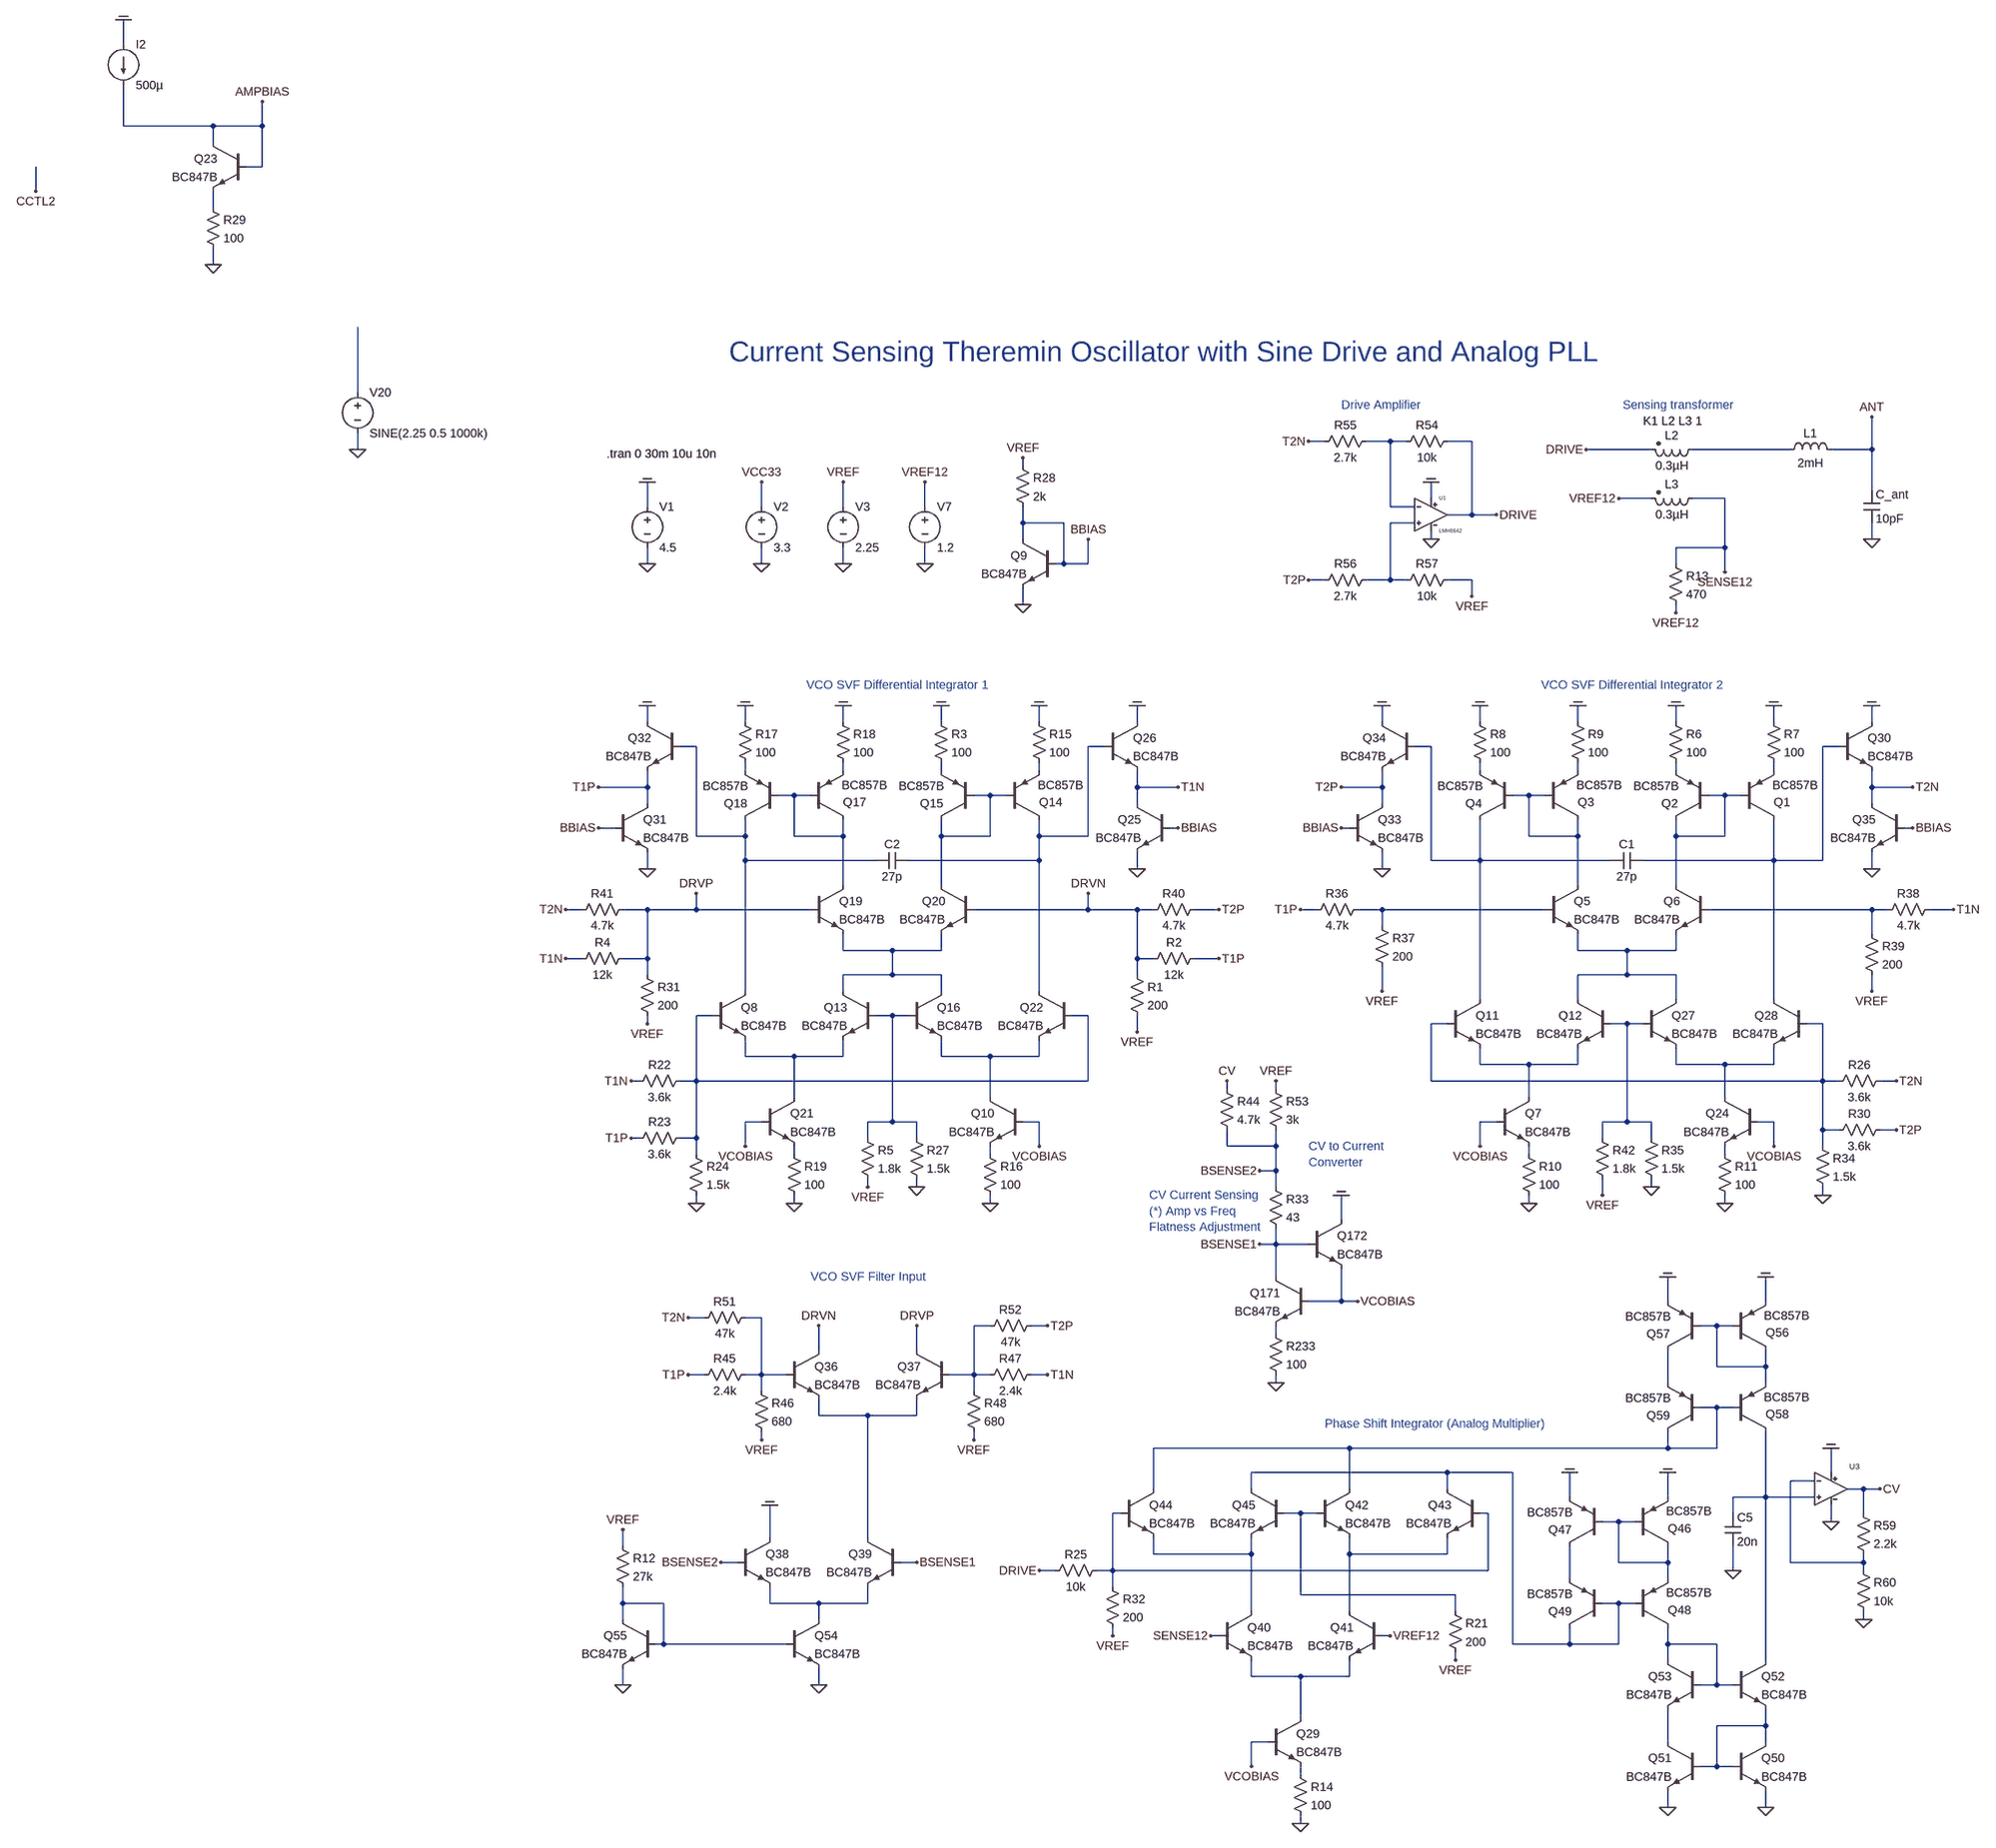
[diagram p0: schematic theremin_oscillator_bjt_pll_v01.asc]
theremin_oscillator_bjt_pll_v01.asc, the LTspice schematic file:
Version 4
SHEET 1 17540 12720
WIRE -192 2960 -192 2912
WIRE -192 3120 -192 3040
WIRE -16 3120 -192 3120
WIRE 80 3120 80 3072
WIRE 80 3120 -16 3120
WIRE -16 3152 -16 3120
WIRE 80 3200 80 3120
WIRE 80 3200 48 3200
WIRE -432 3248 -432 3200
WIRE -16 3280 -16 3248
WIRE -16 3392 -16 3360
WIRE 592 3664 592 3536
WIRE 5200 3760 5168 3760
WIRE 5328 3760 5280 3760
WIRE 5360 3760 5328 3760
WIRE 5488 3760 5440 3760
WIRE 592 3776 592 3744
WIRE 5840 3776 5712 3776
WIRE 6112 3776 5920 3776
WIRE 6272 3776 6272 3712
WIRE 6272 3776 6192 3776
WIRE 4608 3808 4608 3792
WIRE 6272 3856 6272 3776
WIRE 5408 3872 5408 3840
WIRE 5840 3872 5776 3872
WIRE 5984 3872 5920 3872
WIRE 3872 3888 3872 3840
WIRE 4096 3888 4096 3840
WIRE 4256 3888 4256 3840
WIRE 4416 3888 4416 3840
WIRE 5328 3888 5328 3760
WIRE 5376 3888 5328 3888
WIRE 5488 3904 5488 3760
WIRE 5488 3904 5440 3904
WIRE 5536 3904 5488 3904
WIRE 4608 3920 4608 3888
WIRE 4688 3920 4608 3920
WIRE 5376 3920 5328 3920
WIRE 4608 3952 4608 3920
WIRE 5408 3952 5408 3936
WIRE 6272 3952 6272 3920
WIRE 5984 3968 5984 3872
WIRE 5984 3968 5888 3968
WIRE 3872 4000 3872 3968
WIRE 4096 4000 4096 3968
WIRE 4256 4000 4256 3968
WIRE 4416 4000 4416 3968
WIRE 4688 4000 4688 3920
WIRE 4688 4000 4672 4000
WIRE 4736 4000 4736 3952
WIRE 4736 4000 4688 4000
WIRE 5888 4000 5888 3968
WIRE 5984 4016 5984 3968
WIRE 5200 4032 5168 4032
WIRE 5328 4032 5328 3920
WIRE 5328 4032 5280 4032
WIRE 5360 4032 5328 4032
WIRE 5488 4032 5440 4032
WIRE 5488 4064 5488 4032
WIRE 4608 4080 4608 4048
WIRE 5888 4096 5888 4080
WIRE 3872 4320 3872 4288
WIRE 4064 4320 4064 4288
WIRE 4256 4320 4256 4288
WIRE 4448 4320 4448 4288
WIRE 4640 4320 4640 4288
WIRE 4832 4320 4832 4288
WIRE 5312 4320 5312 4288
WIRE 5504 4320 5504 4288
WIRE 5696 4320 5696 4288
WIRE 5888 4320 5888 4288
WIRE 6080 4320 6080 4288
WIRE 6272 4320 6272 4288
WIRE 3968 4368 3936 4368
WIRE 4768 4368 4736 4368
WIRE 5408 4368 5376 4368
WIRE 6208 4368 6176 4368
WIRE 4064 4416 4064 4400
WIRE 4256 4416 4256 4400
WIRE 4448 4416 4448 4400
WIRE 4640 4416 4640 4400
WIRE 5504 4416 5504 4400
WIRE 5696 4416 5696 4400
WIRE 5888 4416 5888 4400
WIRE 6080 4416 6080 4400
WIRE 3872 4448 3872 4416
WIRE 3872 4448 3776 4448
WIRE 4832 4448 4832 4416
WIRE 4912 4448 4832 4448
WIRE 5312 4448 5312 4416
WIRE 5312 4448 5232 4448
WIRE 6272 4448 6272 4416
WIRE 6352 4448 6272 4448
WIRE 4160 4464 4128 4464
WIRE 4192 4464 4160 4464
WIRE 4544 4464 4512 4464
WIRE 4576 4464 4544 4464
WIRE 5600 4464 5568 4464
WIRE 5632 4464 5600 4464
WIRE 5984 4464 5952 4464
WIRE 6016 4464 5984 4464
WIRE 3872 4480 3872 4448
WIRE 4832 4480 4832 4448
WIRE 5312 4480 5312 4448
WIRE 6272 4480 6272 4448
WIRE 3808 4528 3776 4528
WIRE 4912 4528 4896 4528
WIRE 5248 4528 5232 4528
WIRE 6352 4528 6336 4528
WIRE 3968 4544 3968 4368
WIRE 4064 4544 4064 4512
WIRE 4064 4544 3968 4544
WIRE 4160 4544 4160 4464
WIRE 4256 4544 4256 4512
WIRE 4256 4544 4160 4544
WIRE 4448 4544 4448 4512
WIRE 4544 4544 4544 4464
WIRE 4544 4544 4448 4544
WIRE 4640 4544 4640 4512
WIRE 4736 4544 4736 4368
WIRE 4736 4544 4640 4544
WIRE 5600 4544 5600 4464
WIRE 5696 4544 5696 4512
WIRE 5696 4544 5600 4544
WIRE 5888 4544 5888 4512
WIRE 5984 4544 5984 4464
WIRE 5984 4544 5888 4544
WIRE 4064 4592 4064 4544
WIRE 4320 4592 4064 4592
WIRE 4640 4592 4640 4544
WIRE 4640 4592 4384 4592
WIRE 5408 4592 5408 4368
WIRE 5504 4592 5504 4512
WIRE 5504 4592 5408 4592
WIRE 5760 4592 5504 4592
WIRE 6080 4592 6080 4512
WIRE 6080 4592 5824 4592
WIRE 6176 4592 6176 4368
WIRE 6176 4592 6080 4592
WIRE 3872 4608 3872 4576
WIRE 4832 4608 4832 4576
WIRE 5312 4608 5312 4576
WIRE 6272 4608 6272 4576
WIRE 4256 4640 4256 4544
WIRE 4448 4640 4448 4544
WIRE 5696 4640 5696 4544
WIRE 5888 4640 5888 4544
WIRE 3744 4688 3712 4688
WIRE 3872 4688 3824 4688
WIRE 3968 4688 3968 4656
WIRE 3968 4688 3872 4688
WIRE 4192 4688 3968 4688
WIRE 4736 4688 4736 4656
WIRE 4736 4688 4512 4688
WIRE 4832 4688 4736 4688
WIRE 4864 4688 4832 4688
WIRE 4992 4688 4944 4688
WIRE 5184 4688 5152 4688
WIRE 5312 4688 5264 4688
WIRE 5632 4688 5312 4688
WIRE 6272 4688 5952 4688
WIRE 6304 4688 6272 4688
WIRE 6432 4688 6384 4688
WIRE 5312 4720 5312 4688
WIRE 6272 4736 6272 4688
WIRE 4256 4768 4256 4736
WIRE 4352 4768 4256 4768
WIRE 4448 4768 4448 4736
WIRE 4448 4768 4352 4768
WIRE 5696 4768 5696 4736
WIRE 5792 4768 5696 4768
WIRE 5888 4768 5888 4736
WIRE 5888 4768 5792 4768
WIRE 3744 4784 3712 4784
WIRE 3872 4784 3872 4688
WIRE 3872 4784 3824 4784
WIRE 4832 4784 4832 4688
WIRE 4864 4784 4832 4784
WIRE 4992 4784 4944 4784
WIRE 3872 4816 3872 4784
WIRE 4352 4816 4352 4768
WIRE 4352 4816 4256 4816
WIRE 4448 4816 4352 4816
WIRE 4832 4816 4832 4784
WIRE 5792 4816 5792 4768
WIRE 5792 4816 5696 4816
WIRE 5888 4816 5792 4816
WIRE 4064 4848 4064 4592
WIRE 4256 4848 4256 4816
WIRE 4448 4848 4448 4816
WIRE 4640 4848 4640 4592
WIRE 5312 4848 5312 4800
WIRE 6272 4848 6272 4816
WIRE 5504 4864 5504 4592
WIRE 5696 4864 5696 4816
WIRE 5888 4864 5888 4816
WIRE 6080 4864 6080 4592
WIRE 4000 4896 3968 4896
WIRE 4352 4896 4320 4896
WIRE 4384 4896 4352 4896
WIRE 4736 4896 4704 4896
WIRE 3872 4912 3872 4896
WIRE 5440 4912 5408 4912
WIRE 5792 4912 5760 4912
WIRE 5824 4912 5792 4912
WIRE 6176 4912 6144 4912
WIRE 4832 4928 4832 4896
WIRE 4064 4976 4064 4944
WIRE 4160 4976 4064 4976
WIRE 4256 4976 4256 4944
WIRE 4256 4976 4160 4976
WIRE 4448 4976 4448 4944
WIRE 4544 4976 4448 4976
WIRE 4640 4976 4640 4944
WIRE 4640 4976 4544 4976
WIRE 5504 4992 5504 4960
WIRE 5600 4992 5504 4992
WIRE 5696 4992 5696 4960
WIRE 5696 4992 5600 4992
WIRE 5888 4992 5888 4960
WIRE 5984 4992 5888 4992
WIRE 6080 4992 6080 4960
WIRE 6080 4992 5984 4992
WIRE 3856 5024 3840 5024
WIRE 3968 5024 3968 4896
WIRE 3968 5024 3936 5024
WIRE 4736 5024 4736 4896
WIRE 4736 5024 3968 5024
WIRE 5408 5024 5408 4912
WIRE 6176 5024 6176 4912
WIRE 6176 5024 5408 5024
WIRE 6208 5024 6176 5024
WIRE 6320 5024 6288 5024
WIRE 5008 5040 5008 5024
WIRE 5104 5040 5104 5024
WIRE 4160 5056 4160 4976
WIRE 4544 5056 4544 4976
WIRE 5600 5056 5600 4992
WIRE 5984 5056 5984 4992
WIRE 4096 5104 4064 5104
WIRE 4352 5104 4352 4896
WIRE 4352 5104 4304 5104
WIRE 4400 5104 4352 5104
WIRE 4640 5104 4608 5104
WIRE 5536 5104 5504 5104
WIRE 5792 5104 5792 4912
WIRE 5792 5104 5744 5104
WIRE 5840 5104 5792 5104
WIRE 6080 5104 6048 5104
WIRE 6176 5120 6176 5024
WIRE 6208 5120 6176 5120
WIRE 6320 5120 6288 5120
WIRE 3856 5136 3840 5136
WIRE 3968 5136 3968 5024
WIRE 3968 5136 3936 5136
WIRE 4304 5136 4304 5104
WIRE 4400 5136 4400 5104
WIRE 5744 5136 5744 5104
WIRE 5840 5136 5840 5104
WIRE 4064 5152 4064 5104
WIRE 4640 5152 4640 5104
WIRE 5008 5152 5008 5120
WIRE 5104 5152 5104 5120
WIRE 5104 5152 5008 5152
WIRE 5504 5152 5504 5104
WIRE 6080 5152 6080 5104
WIRE 6176 5152 6176 5120
WIRE 3968 5168 3968 5136
WIRE 4160 5168 4160 5152
WIRE 4544 5168 4544 5152
WIRE 5600 5168 5600 5152
WIRE 5984 5168 5984 5152
WIRE 5104 5200 5104 5152
WIRE 5104 5200 5072 5200
WIRE 4304 5232 4304 5216
WIRE 4400 5232 4400 5216
WIRE 5104 5232 5104 5200
WIRE 5840 5232 5840 5216
WIRE 5744 5248 5744 5216
WIRE 6176 5248 6176 5232
WIRE 3968 5264 3968 5248
WIRE 4160 5264 4160 5248
WIRE 4544 5264 4544 5248
WIRE 5600 5264 5600 5248
WIRE 5984 5264 5984 5248
WIRE 5232 5296 5232 5248
WIRE 5104 5344 5104 5312
WIRE 5104 5344 5072 5344
WIRE 5168 5344 5104 5344
WIRE 5104 5408 5104 5344
WIRE 5232 5456 5232 5392
WIRE 5232 5456 5168 5456
WIRE 5264 5456 5232 5456
WIRE 5872 5456 5872 5408
WIRE 6064 5456 6064 5408
WIRE 3984 5488 3952 5488
WIRE 4096 5488 4064 5488
WIRE 4544 5504 4512 5504
WIRE 4656 5504 4624 5504
WIRE 5968 5504 5936 5504
WIRE 6000 5504 5968 5504
WIRE 5104 5520 5104 5504
WIRE 4208 5552 4208 5504
WIRE 4400 5552 4400 5504
WIRE 5968 5584 5968 5504
WIRE 6064 5584 6064 5552
WIRE 6064 5584 5968 5584
WIRE 3984 5600 3952 5600
WIRE 4096 5600 4096 5488
WIRE 4096 5600 4064 5600
WIRE 4144 5600 4096 5600
WIRE 4512 5600 4512 5504
WIRE 4512 5600 4464 5600
WIRE 4544 5600 4512 5600
WIRE 4656 5600 4624 5600
WIRE 5104 5616 5104 5600
WIRE 5872 5616 5872 5552
WIRE 6064 5616 6064 5584
WIRE 4096 5632 4096 5600
WIRE 4512 5632 4512 5600
WIRE 5968 5664 5936 5664
WIRE 6000 5664 5968 5664
WIRE 4208 5680 4208 5648
WIRE 4304 5680 4208 5680
WIRE 4400 5680 4400 5648
WIRE 4400 5680 4304 5680
WIRE 4096 5728 4096 5712
WIRE 4512 5728 4512 5712
WIRE 5248 5744 4864 5744
WIRE 5872 5744 5872 5712
WIRE 5872 5744 5248 5744
WIRE 5968 5744 5968 5664
WIRE 5968 5744 5872 5744
WIRE 5440 5792 5056 5792
WIRE 5568 5792 5440 5792
WIRE 6192 5792 6192 5744
WIRE 6160 5808 6112 5808
WIRE 4864 5824 4864 5744
WIRE 5056 5824 5056 5792
WIRE 5248 5824 5248 5744
WIRE 5440 5824 5440 5792
WIRE 6256 5824 6224 5824
WIRE 6288 5824 6256 5824
WIRE 5680 5840 5680 5792
WIRE 5872 5840 5872 5792
WIRE 6064 5840 6064 5712
WIRE 6064 5840 6000 5840
WIRE 6160 5840 6064 5840
WIRE 4800 5872 4784 5872
WIRE 5152 5872 5120 5872
WIRE 5184 5872 5152 5872
WIRE 5520 5872 5504 5872
WIRE 6000 5872 6000 5840
WIRE 6256 5872 6256 5824
WIRE 5776 5888 5744 5888
WIRE 5808 5888 5776 5888
WIRE 6192 5888 6192 5856
WIRE 4112 5920 4112 5856
WIRE 4304 5920 4304 5680
WIRE 3824 5936 3824 5904
WIRE 4864 5952 4864 5920
WIRE 5056 5952 5056 5920
WIRE 5056 5952 4864 5952
WIRE 5248 5952 5248 5920
WIRE 5440 5952 5440 5920
WIRE 5440 5952 5248 5952
WIRE 4048 5968 4016 5968
WIRE 4400 5968 4368 5968
WIRE 5776 5968 5776 5888
WIRE 5872 5968 5872 5936
WIRE 5872 5968 5776 5968
WIRE 6112 5968 6112 5808
WIRE 6256 5968 6256 5952
WIRE 6256 5968 6112 5968
WIRE 4672 5984 4640 5984
WIRE 4784 5984 4784 5872
WIRE 4784 5984 4752 5984
WIRE 5520 5984 5520 5872
WIRE 5520 5984 4784 5984
WIRE 6000 5984 6000 5936
WIRE 6256 5984 6256 5968
WIRE 5680 6000 5680 5936
WIRE 5872 6000 5872 5968
WIRE 4784 6016 4784 5984
WIRE 5152 6032 5152 5872
WIRE 5456 6032 5152 6032
WIRE 3824 6048 3824 6016
WIRE 3904 6048 3824 6048
WIRE 4112 6048 4112 6016
WIRE 4208 6048 4112 6048
WIRE 4304 6048 4304 6016
WIRE 4304 6048 4208 6048
WIRE 5776 6048 5744 6048
WIRE 5808 6048 5776 6048
WIRE 5056 6064 5056 5952
WIRE 5248 6064 5248 5952
WIRE 5456 6064 5456 6032
WIRE 3824 6080 3824 6048
WIRE 4208 6080 4208 6048
WIRE 6256 6080 6256 6064
WIRE 4784 6112 4784 6096
WIRE 4992 6112 4976 6112
WIRE 5328 6112 5312 6112
WIRE 3904 6128 3904 6048
WIRE 3904 6128 3888 6128
WIRE 4144 6128 3904 6128
WIRE 5568 6128 5568 5792
WIRE 5680 6128 5680 6096
WIRE 5680 6128 5568 6128
WIRE 5776 6128 5776 6048
WIRE 5776 6128 5680 6128
WIRE 5872 6128 5872 6096
WIRE 5968 6128 5872 6128
WIRE 5456 6160 5456 6144
WIRE 5872 6160 5872 6128
WIRE 6064 6160 6064 5840
WIRE 5056 6192 5056 6160
WIRE 5152 6192 5056 6192
WIRE 5248 6192 5248 6160
WIRE 5248 6192 5152 6192
WIRE 3824 6208 3824 6176
WIRE 4208 6208 4208 6176
WIRE 5968 6208 5968 6128
WIRE 5968 6208 5936 6208
WIRE 6000 6208 5968 6208
WIRE 5152 6272 5152 6192
WIRE 6064 6288 6064 6256
WIRE 6064 6288 5968 6288
WIRE 5088 6320 5056 6320
WIRE 5872 6320 5872 6256
WIRE 6064 6320 6064 6288
WIRE 5056 6368 5056 6320
WIRE 5968 6368 5968 6288
WIRE 5968 6368 5936 6368
WIRE 6000 6368 5968 6368
WIRE 5152 6384 5152 6368
WIRE 5872 6448 5872 6416
WIRE 6064 6448 6064 6416
WIRE 5152 6480 5152 6464
FLAG 3872 4000 0
FLAG 3872 3840 COM
FLAG 4096 4000 0
FLAG 4096 3840 VCC33
FLAG 4256 4000 0
FLAG 4256 3840 VREF
FLAG 6272 3712 ANT
FLAG 6272 3952 0
FLAG 5712 3776 DRIVE
FLAG 4416 4000 0
FLAG 4416 3840 VREF12
FLAG 5776 3872 VREF12
FLAG 5984 4016 SENSE12
FLAG 5888 4096 VREF12
FLAG -432 3248 CCTL2
FLAG 592 3776 0
FLAG 5104 5616 0
FLAG 5232 5248 COM
FLAG 5264 5456 VCOBIAS
FLAG -16 3392 0
FLAG -192 2912 COM
FLAG 80 3072 AMPBIAS
FLAG 5072 5344 BSENSE1
FLAG 5072 5200 BSENSE2
FLAG 4608 4080 0
FLAG 4736 3952 BBIAS
FLAG 4608 3792 VREF
FLAG 4448 4288 COM
FLAG 4640 4288 COM
FLAG 4064 4288 COM
FLAG 4256 4288 COM
FLAG 4160 5264 0
FLAG 4064 5152 VCOBIAS
FLAG 4544 5264 0
FLAG 4640 5152 VCOBIAS
FLAG 4832 4608 0
FLAG 4832 4288 COM
FLAG 4912 4448 T1N
FLAG 3872 4608 0
FLAG 3776 4528 BBIAS
FLAG 3872 4288 COM
FLAG 4912 4528 BBIAS
FLAG 3776 4448 T1P
FLAG 3968 5264 0
FLAG 3840 5136 T1P
FLAG 3840 5024 T1N
FLAG 4400 5232 0
FLAG 3872 4912 VREF
FLAG 4832 4928 VREF
FLAG 4992 4784 T1P
FLAG 3712 4784 T1N
FLAG 4304 5232 VREF
FLAG 5888 4288 COM
FLAG 6080 4288 COM
FLAG 5504 4288 COM
FLAG 5696 4288 COM
FLAG 5600 5264 0
FLAG 5504 5152 VCOBIAS
FLAG 5984 5264 0
FLAG 6080 5152 VCOBIAS
FLAG 6272 4608 0
FLAG 6272 4288 COM
FLAG 6352 4448 T2N
FLAG 5312 4608 0
FLAG 5232 4528 BBIAS
FLAG 5312 4288 COM
FLAG 6352 4528 BBIAS
FLAG 5232 4448 T2P
FLAG 6176 5248 0
FLAG 6320 5120 T2P
FLAG 6320 5024 T2N
FLAG 5840 5232 0
FLAG 5152 4688 T1P
FLAG 6432 4688 T1N
FLAG 5312 4848 VREF
FLAG 6272 4848 VREF
FLAG 5744 5248 VREF
FLAG 4992 4688 T2P
FLAG 3712 4688 T2N
FLAG 4208 6208 0
FLAG 3824 6208 0
FLAG 3824 5904 VREF
FLAG 4736 4656 DRVN
FLAG 3968 4656 DRVP
FLAG 3952 5600 T1P
FLAG 4656 5600 T1N
FLAG 4512 5728 VREF
FLAG 4208 5504 DRVN
FLAG 4400 5504 DRVP
FLAG 3952 5488 T2N
FLAG 4656 5504 T2P
FLAG 4096 5728 VREF
FLAG 4016 5968 BSENSE2
FLAG 4400 5968 BSENSE1
FLAG 5408 3840 COM
FLAG 5408 3952 0
FLAG 5168 3760 T2N
FLAG 5168 4032 T2P
FLAG 5488 4064 VREF
FLAG 5536 3904 DRIVE
FLAG 4112 5856 COM
FLAG 5152 6480 0
FLAG 5056 6368 VCOBIAS
FLAG 5328 6112 VREF12
FLAG 4976 6112 SENSE12
FLAG 5680 5792 COM
FLAG 5872 5792 COM
FLAG 6064 6448 0
FLAG 5872 6448 0
FLAG 5872 5408 COM
FLAG 6064 5408 COM
FLAG 5456 6160 VREF
FLAG 4640 5984 DRIVE
FLAG 4784 6112 VREF
FLAG 6288 5824 CV
FLAG 5008 5024 CV
FLAG 5104 5024 VREF
FLAG 6192 5888 0
FLAG 6192 5744 COM
FLAG 6256 6080 0
FLAG 6000 5984 0
SYMBOL voltage 3872 3872 R0
SYMATTR InstName V1
SYMATTR Value 4.5
SYMBOL voltage 4096 3872 R0
SYMATTR InstName V2
SYMATTR Value 3.3
SYMBOL voltage 4256 3872 R0
SYMATTR InstName V3
SYMATTR Value 2.25
SYMBOL ind 6096 3792 R270
WINDOW 0 32 56 VTop 2
WINDOW 3 5 56 VBottom 2
SYMATTR InstName L1
SYMATTR Value 2mH
SYMATTR SpiceLine Rser=120 Cpar=1pF
SYMBOL Cap 6256 3856 R0
SYMATTR InstName C_ant
SYMATTR Value 10pF
SYMBOL voltage 4416 3872 R0
SYMATTR InstName V7
SYMATTR Value 1.2
SYMBOL ind2 5936 3760 R90
WINDOW 0 4 56 VBottom 2
WINDOW 3 32 56 VTop 2
SYMATTR InstName L2
SYMATTR Value 0.3µH
SYMATTR SpiceLine Rser=0.1 Cpar=0.1p
SYMBOL ind2 5936 3856 R90
WINDOW 0 4 56 VBottom 2
WINDOW 3 32 56 VTop 2
SYMATTR InstName L3
SYMATTR Value 0.3µH
SYMATTR SpiceLine Rser=0.1 Cpar=0.1p
SYMBOL Res 5872 3984 R0
SYMATTR InstName R13
SYMATTR Value 470
SYMBOL Voltage 592 3648 R0
SYMATTR InstName V20
SYMATTR Value SINE(2.25 0.5 1000k)
SYMBOL Res 5088 5504 R0
SYMATTR InstName R233
SYMATTR Value 100
SYMBOL npn 5168 5408 M0
SYMATTR InstName Q171
SYMATTR Value BC847B
SYMBOL npn 5168 5296 R0
SYMATTR InstName Q172
SYMATTR Value BC847B
SYMBOL npn 48 3152 M0
SYMATTR InstName Q23
SYMATTR Value BC847B
SYMBOL Res -32 3264 R0
SYMATTR InstName R29
SYMATTR Value 100
SYMBOL current -192 2960 R0
SYMATTR InstName I2
SYMATTR Value 500µ
SYMBOL Res 5088 5216 R0
SYMATTR InstName R33
SYMATTR Value 43
SYMBOL npn 4672 3952 M0
SYMATTR InstName Q9
SYMATTR Value BC847B
SYMBOL pnp 4576 4512 M180
WINDOW 0 64 34 Left 2
WINDOW 3 61 68 Left 2
SYMATTR InstName Q14
SYMATTR Value BC857B
SYMBOL pnp 4512 4512 R180
WINDOW 0 60 32 Left 2
WINDOW 3 58 66 Left 2
SYMATTR InstName Q15
SYMATTR Value BC857B
SYMBOL Res 4432 4304 R0
SYMATTR InstName R3
SYMATTR Value 100
SYMBOL Res 4624 4304 R0
SYMATTR InstName R15
SYMATTR Value 100
SYMBOL pnp 4192 4512 M180
WINDOW 0 64 34 Left 2
WINDOW 3 61 68 Left 2
SYMATTR InstName Q17
SYMATTR Value BC857B
SYMBOL pnp 4128 4512 R180
WINDOW 0 60 32 Left 2
WINDOW 3 58 66 Left 2
SYMATTR InstName Q18
SYMATTR Value BC857B
SYMBOL Res 4048 4304 R0
SYMATTR InstName R17
SYMATTR Value 100
SYMBOL Res 4240 4304 R0
SYMATTR InstName R18
SYMATTR Value 100
SYMBOL npn 4192 4640 R0
SYMATTR InstName Q19
SYMATTR Value BC847B
SYMBOL npn 4512 4640 M0
SYMATTR InstName Q20
SYMATTR Value BC847B
SYMBOL Res 4144 5152 R0
SYMATTR InstName R19
SYMATTR Value 100
SYMBOL npn 4096 5056 R0
SYMATTR InstName Q21
SYMATTR Value BC847B
SYMBOL npn 4000 4848 R0
SYMATTR InstName Q8
SYMATTR Value BC847B
SYMBOL npn 4320 4848 M0
SYMATTR InstName Q13
SYMATTR Value BC847B
SYMBOL npn 4384 4848 R0
SYMATTR InstName Q16
SYMATTR Value BC847B
SYMBOL npn 4704 4848 M0
SYMATTR InstName Q22
SYMATTR Value BC847B
SYMBOL Res 4528 5152 R0
SYMATTR InstName R16
SYMATTR Value 100
SYMBOL Cap 4384 4576 R90
WINDOW 0 0 32 VBottom 2
WINDOW 3 32 32 VTop 2
SYMATTR InstName C2
SYMATTR Value 27p
SYMBOL npn 4768 4320 R0
SYMATTR InstName Q26
SYMATTR Value BC847B
SYMBOL npn 3808 4480 R0
SYMATTR InstName Q31
SYMATTR Value BC847B
SYMBOL npn 3936 4320 M0
SYMATTR InstName Q32
SYMATTR Value BC847B
SYMBOL npn 4896 4480 M0
SYMATTR InstName Q25
SYMATTR Value BC847B
SYMBOL Res 3952 5008 R90
WINDOW 0 0 56 VBottom 2
WINDOW 3 32 56 VTop 2
SYMATTR InstName R22
SYMATTR Value 3.6k
SYMBOL Res 3952 5120 R90
WINDOW 0 0 56 VBottom 2
WINDOW 3 32 56 VTop 2
SYMATTR InstName R23
SYMATTR Value 3.6k
SYMBOL Res 3952 5152 R0
SYMATTR InstName R24
SYMATTR Value 1.5k
SYMBOL Res 4384 5120 R0
SYMATTR InstName R27
SYMATTR Value 1.5k
SYMBOL Res 3856 4800 R0
SYMATTR InstName R31
SYMATTR Value 200
SYMBOL Res 4816 4800 R0
SYMATTR InstName R1
SYMATTR Value 200
SYMBOL Res 4960 4768 R90
WINDOW 0 0 56 VBottom 2
WINDOW 3 32 56 VTop 2
SYMATTR InstName R2
SYMATTR Value 12k
SYMBOL Res 3840 4768 R90
WINDOW 0 0 56 VBottom 2
WINDOW 3 32 56 VTop 2
SYMATTR InstName R4
SYMATTR Value 12k
SYMBOL Res 4288 5120 R0
SYMATTR InstName R5
SYMATTR Value 1.8k
SYMBOL pnp 6016 4512 M180
WINDOW 0 64 34 Left 2
WINDOW 3 61 68 Left 2
SYMATTR InstName Q1
SYMATTR Value BC857B
SYMBOL pnp 5952 4512 R180
WINDOW 0 60 32 Left 2
WINDOW 3 58 66 Left 2
SYMATTR InstName Q2
SYMATTR Value BC857B
SYMBOL Res 5872 4304 R0
SYMATTR InstName R6
SYMATTR Value 100
SYMBOL Res 6064 4304 R0
SYMATTR InstName R7
SYMATTR Value 100
SYMBOL pnp 5632 4512 M180
WINDOW 0 64 34 Left 2
WINDOW 3 61 68 Left 2
SYMATTR InstName Q3
SYMATTR Value BC857B
SYMBOL pnp 5568 4512 R180
WINDOW 0 60 32 Left 2
WINDOW 3 58 66 Left 2
SYMATTR InstName Q4
SYMATTR Value BC857B
SYMBOL Res 5488 4304 R0
SYMATTR InstName R8
SYMATTR Value 100
SYMBOL Res 5680 4304 R0
SYMATTR InstName R9
SYMATTR Value 100
SYMBOL npn 5632 4640 R0
SYMATTR InstName Q5
SYMATTR Value BC847B
SYMBOL npn 5952 4640 M0
SYMATTR InstName Q6
SYMATTR Value BC847B
SYMBOL Res 5584 5152 R0
SYMATTR InstName R10
SYMATTR Value 100
SYMBOL npn 5536 5056 R0
SYMATTR InstName Q7
SYMATTR Value BC847B
SYMBOL npn 5440 4864 R0
SYMATTR InstName Q11
SYMATTR Value BC847B
SYMBOL npn 5760 4864 M0
SYMATTR InstName Q12
SYMATTR Value BC847B
SYMBOL npn 5824 4864 R0
SYMATTR InstName Q27
SYMATTR Value BC847B
SYMBOL npn 6144 4864 M0
SYMATTR InstName Q28
SYMATTR Value BC847B
SYMBOL Res 5968 5152 R0
SYMATTR InstName R11
SYMATTR Value 100
SYMBOL Cap 5824 4576 R90
WINDOW 0 0 32 VBottom 2
WINDOW 3 32 32 VTop 2
SYMATTR InstName C1
SYMATTR Value 27p
SYMBOL npn 6208 4320 R0
SYMATTR InstName Q30
SYMATTR Value BC847B
SYMBOL npn 5248 4480 R0
SYMATTR InstName Q33
SYMATTR Value BC847B
SYMBOL npn 5376 4320 M0
SYMATTR InstName Q34
SYMATTR Value BC847B
SYMBOL npn 6336 4480 M0
SYMATTR InstName Q35
SYMATTR Value BC847B
SYMBOL Res 6304 5008 R90
WINDOW 0 0 56 VBottom 2
WINDOW 3 32 56 VTop 2
SYMATTR InstName R26
SYMATTR Value 3.6k
SYMBOL Res 6304 5104 R90
WINDOW 0 0 56 VBottom 2
WINDOW 3 32 56 VTop 2
SYMATTR InstName R30
SYMATTR Value 3.6k
SYMBOL Res 6160 5136 R0
SYMATTR InstName R34
SYMATTR Value 1.5k
SYMBOL Res 5824 5120 R0
SYMATTR InstName R35
SYMATTR Value 1.5k
SYMBOL Res 5280 4672 R90
WINDOW 0 0 56 VBottom 2
WINDOW 3 32 56 VTop 2
SYMATTR InstName R36
SYMATTR Value 4.7k
SYMBOL Res 5296 4704 R0
SYMATTR InstName R37
SYMATTR Value 200
SYMBOL Res 6400 4672 R90
WINDOW 0 0 56 VBottom 2
WINDOW 3 32 56 VTop 2
SYMATTR InstName R38
SYMATTR Value 4.7k
SYMBOL Res 6256 4720 R0
SYMATTR InstName R39
SYMATTR Value 200
SYMBOL Res 5728 5120 R0
SYMATTR InstName R42
SYMATTR Value 1.8k
SYMBOL Res 4960 4672 R90
WINDOW 0 0 56 VBottom 2
WINDOW 3 32 56 VTop 2
SYMATTR InstName R40
SYMATTR Value 4.7k
SYMBOL Res 3840 4672 R90
WINDOW 0 0 56 VBottom 2
WINDOW 3 32 56 VTop 2
SYMATTR InstName R41
SYMATTR Value 4.7k
SYMBOL npn 4144 6080 R0
SYMATTR InstName Q54
SYMATTR Value BC847B
SYMBOL npn 3888 6080 M0
SYMATTR InstName Q55
SYMATTR Value BC847B
SYMBOL npn 4144 5552 R0
SYMATTR InstName Q36
SYMATTR Value BC847B
SYMBOL npn 4464 5552 M0
SYMATTR InstName Q37
SYMATTR Value BC847B
SYMBOL Res 4080 5584 R90
WINDOW 0 0 56 VBottom 2
WINDOW 3 32 56 VTop 2
SYMATTR InstName R45
SYMATTR Value 2.4k
SYMBOL Res 4080 5616 R0
SYMATTR InstName R46
SYMATTR Value 680
SYMBOL Res 4640 5584 R90
WINDOW 0 0 56 VBottom 2
WINDOW 3 32 56 VTop 2
SYMATTR InstName R47
SYMATTR Value 2.4k
SYMBOL Res 4496 5616 R0
SYMATTR InstName R48
SYMATTR Value 680
SYMBOL Res 4080 5472 R90
WINDOW 0 0 56 VBottom 2
WINDOW 3 32 56 VTop 2
SYMATTR InstName R51
SYMATTR Value 47k
SYMBOL Res 4640 5488 R90
WINDOW 0 0 56 VBottom 2
WINDOW 3 32 56 VTop 2
SYMATTR InstName R52
SYMATTR Value 47k
SYMBOL npn 4048 5920 R0
SYMATTR InstName Q38
SYMATTR Value BC847B
SYMBOL npn 4368 5920 M0
SYMATTR InstName Q39
SYMATTR Value BC847B
SYMBOL LMH6642 5408 3840 R0
SYMATTR InstName U1
SYMBOL Res 5456 3744 R90
WINDOW 0 0 56 VBottom 2
WINDOW 3 32 56 VTop 2
SYMATTR InstName R54
SYMATTR Value 10k
SYMBOL Res 5296 3744 R90
WINDOW 0 0 56 VBottom 2
WINDOW 3 32 56 VTop 2
SYMATTR InstName R55
SYMATTR Value 2.7k
SYMBOL Res 5296 4016 R90
WINDOW 0 0 56 VBottom 2
WINDOW 3 32 56 VTop 2
SYMATTR InstName R56
SYMATTR Value 2.7k
SYMBOL Res 5456 4016 R90
WINDOW 0 0 56 VBottom 2
WINDOW 3 32 56 VTop 2
SYMATTR InstName R57
SYMATTR Value 10k
SYMBOL Res 4592 3792 R0
SYMATTR InstName R28
SYMATTR Value 2k
SYMBOL Res 3808 5920 R0
SYMATTR InstName R12
SYMATTR Value 27k
SYMBOL npn 4608 5056 M0
SYMATTR InstName Q10
SYMATTR Value BC847B
SYMBOL npn 6048 5056 M0
SYMATTR InstName Q24
SYMATTR Value BC847B
SYMBOL Res 5136 6368 R0
SYMATTR InstName R14
SYMATTR Value 100
SYMBOL npn 5088 6272 R0
SYMATTR InstName Q29
SYMATTR Value BC847B
SYMBOL npn 4992 6064 R0
SYMATTR InstName Q40
SYMATTR Value BC847B
SYMBOL npn 5312 6064 M0
SYMATTR InstName Q41
SYMATTR Value BC847B
SYMBOL npn 5184 5824 R0
SYMATTR InstName Q42
SYMATTR Value BC847B
SYMBOL npn 5504 5824 M0
SYMATTR InstName Q43
SYMATTR Value BC847B
SYMBOL npn 4800 5824 R0
SYMATTR InstName Q44
SYMATTR Value BC847B
SYMBOL npn 5120 5824 M0
SYMATTR InstName Q45
SYMATTR Value BC847B
SYMBOL pnp 5808 5936 M180
WINDOW 0 64 34 Left 2
WINDOW 3 61 68 Left 2
SYMATTR InstName Q46
SYMATTR Value BC857B
SYMBOL pnp 5744 5936 R180
WINDOW 0 60 32 Left 2
WINDOW 3 58 66 Left 2
SYMATTR InstName Q47
SYMATTR Value BC857B
SYMBOL pnp 5808 6096 M180
WINDOW 0 64 34 Left 2
WINDOW 3 61 68 Left 2
SYMATTR InstName Q48
SYMATTR Value BC857B
SYMBOL pnp 5744 6096 R180
WINDOW 0 60 32 Left 2
WINDOW 3 58 66 Left 2
SYMATTR InstName Q49
SYMATTR Value BC857B
SYMBOL npn 6000 6320 R0
SYMATTR InstName Q50
SYMATTR Value BC847B
SYMBOL npn 5936 6320 M0
SYMATTR InstName Q51
SYMATTR Value BC847B
SYMBOL npn 6000 6160 R0
SYMATTR InstName Q52
SYMATTR Value BC847B
SYMBOL npn 5936 6160 M0
SYMATTR InstName Q53
SYMATTR Value BC847B
SYMBOL pnp 6000 5552 M180
WINDOW 0 64 34 Left 2
WINDOW 3 61 68 Left 2
SYMATTR InstName Q56
SYMATTR Value BC857B
SYMBOL pnp 5936 5552 R180
WINDOW 0 60 32 Left 2
WINDOW 3 58 66 Left 2
SYMATTR InstName Q57
SYMATTR Value BC857B
SYMBOL pnp 6000 5712 M180
WINDOW 0 64 34 Left 2
WINDOW 3 61 68 Left 2
SYMATTR InstName Q58
SYMATTR Value BC857B
SYMBOL pnp 5936 5712 R180
WINDOW 0 60 32 Left 2
WINDOW 3 58 66 Left 2
SYMATTR InstName Q59
SYMATTR Value BC857B
SYMBOL Res 5440 6048 R0
SYMATTR InstName R21
SYMATTR Value 200
SYMBOL Res 4768 5968 R90
WINDOW 0 0 56 VBottom 2
WINDOW 3 32 56 VTop 2
SYMATTR InstName R25
SYMATTR Value 10k
SYMBOL Res 4768 6000 R0
SYMATTR InstName R32
SYMATTR Value 200
SYMBOL Res 4992 5024 R0
SYMATTR InstName R44
SYMATTR Value 4.7k
SYMBOL Res 5088 5024 R0
SYMATTR InstName R53
SYMATTR Value 3k
SYMBOL MCP6021 6192 5824 R0
SYMATTR InstName U3
SYMBOL Res 6240 5856 R0
SYMATTR InstName R59
SYMATTR Value 2.2k
SYMBOL Res 6240 5968 R0
SYMATTR InstName R60
SYMATTR Value 10k
SYMBOL Cap 5984 5872 R0
SYMATTR InstName C5
SYMATTR Value 20n
TEXT 3792 3784 Left 2 !.tran 0 30m 10u 10n
TEXT 4032 3584 Left 5 ;Current Sensing Theremin Oscillator with Sine Drive and Analog PLL
TEXT 5824 3720 Left 2 !K1 L2 L3 1
TEXT 5784 3688 Left 2 ;Sensing transformer
TEXT 5232 3688 Left 2 ;Drive Amplifier
TEXT 4184 4248 Left 2 ;VCO SVF Differential Integrator 1
TEXT 5624 4248 Left 2 ;VCO SVF Differential Integrator 2
TEXT 4192 5408 Left 2 ;VCO SVF Filter Input
TEXT 5200 5696 Left 2 ;Phase Shift Integrator (Analog Multiplier)
TEXT 5168 5152 Left 2 ;CV to Current\nConverter
TEXT 4856 5248 Left 2 ;CV Current Sensing\n(*) Amp vs Freq \nFlatness Adjustment

The netlist it stands for:
* theremin_oscillator_bjt_pll_v01.asc
V1 COM 0 4.5
V2 VCC33 0 3.3
V3 VREF 0 2.25
L1 N004 ANT 2mH Rser=120 Cpar=1pF
C_ant ANT 0 10pF
V7 VREF12 0 1.2
L2 N004 DRIVE 0.3µH Rser=0.1 Cpar=0.1p
L3 SENSE12 VREF12 0.3µH Rser=0.1 Cpar=0.1p
R13 SENSE12 VREF12 470
V20 N002 0 SINE(2.25 0.5 1000k)
R233 N041 0 100
Q171 BSENSE1 VCOBIAS N041 0 BC847B
Q172 COM BSENSE1 VCOBIAS 0 BC847B
Q23 AMPBIAS AMPBIAS N001 0 BC847B
R29 N001 0 100
I2 COM AMPBIAS 500µ
R33 BSENSE2 BSENSE1 43
Q9 BBIAS BBIAS 0 0 BC847B
Q14 N007 N019 N013 0 BC857B
Q15 N019 N019 N012 0 BC857B
R3 COM N012 100
R15 COM N013 100
Q17 N018 N018 N011 0 BC857B
Q18 N006 N018 N010 0 BC857B
R17 COM N010 100
R18 COM N011 100
Q19 N018 DRVP N024 0 BC847B
Q20 N019 DRVN N024 0 BC847B
R19 N034 0 100
Q21 N030 VCOBIAS N034 0 BC847B
Q8 N006 N026 N030 0 BC847B
Q13 N024 N027 N030 0 BC847B
Q16 N024 N027 N031 0 BC847B
Q22 N007 N026 N031 0 BC847B
R16 N035 0 100
C2 N007 N006 27p
Q26 COM N007 T1N 0 BC847B
Q31 T1P BBIAS 0 0 BC847B
Q32 COM N006 T1P 0 BC847B
Q25 T1N BBIAS 0 0 BC847B
R22 N026 T1N 3.6k
R23 N026 T1P 3.6k
R24 N026 0 1.5k
R27 N027 0 1.5k
R31 DRVP VREF 200
R1 DRVN VREF 200
R2 T1P DRVN 12k
R4 DRVP T1N 12k
R5 N027 VREF 1.8k
Q1 N009 N021 N017 0 BC857B
Q2 N021 N021 N016 0 BC857B
R6 COM N016 100
R7 COM N017 100
Q3 N020 N020 N015 0 BC857B
Q4 N008 N020 N014 0 BC857B
R8 COM N014 100
R9 COM N015 100
Q5 N020 N022 N025 0 BC847B
Q6 N021 N023 N025 0 BC847B
R10 N036 0 100
Q7 N032 VCOBIAS N036 0 BC847B
Q11 N008 N028 N032 0 BC847B
Q12 N025 N029 N032 0 BC847B
Q27 N025 N029 N033 0 BC847B
Q28 N009 N028 N033 0 BC847B
R11 N037 0 100
C1 N009 N008 27p
Q30 COM N009 T2N 0 BC847B
Q33 T2P BBIAS 0 0 BC847B
Q34 COM N008 T2P 0 BC847B
Q35 T2N BBIAS 0 0 BC847B
R26 T2N N028 3.6k
R30 T2P N028 3.6k
R34 N028 0 1.5k
R35 N029 0 1.5k
R36 N022 T1P 4.7k
R37 N022 VREF 200
R38 T1N N023 4.7k
R39 N023 VREF 200
R42 N029 VREF 1.8k
R40 T2P DRVN 4.7k
R41 DRVP T2N 4.7k
Q54 N055 N054 0 0 BC847B
Q55 N054 N054 0 0 BC847B
Q36 DRVN N038 N044 0 BC847B
Q37 DRVP N039 N044 0 BC847B
R45 N038 T1P 2.4k
R46 N038 VREF 680
R47 T1N N039 2.4k
R48 N039 VREF 680
R51 N038 T2N 47k
R52 T2P N039 47k
Q38 COM BSENSE2 N055 0 BC847B
Q39 N044 BSENSE1 N055 0 BC847B
XU1 N003 N005 COM 0 DRIVE LMH6642  ; pins In- In+ V+ V- OUT
R54 DRIVE N003 10k
R55 N003 T2N 2.7k
R56 N005 T2P 2.7k
R57 VREF N005 10k
R28 VREF BBIAS 2k
R12 VREF N054 27k
Q10 N031 VCOBIAS N035 0 BC847B
Q24 N033 VCOBIAS N037 0 BC847B
R14 N060 0 100
Q29 N057 VCOBIAS N060 0 BC847B
Q40 N051 SENSE12 N057 0 BC847B
Q41 N052 VREF12 N057 0 BC847B
Q42 N043 N049 N052 0 BC847B
Q43 N045 N048 N052 0 BC847B
Q44 N043 N048 N051 0 BC847B
Q45 N045 N049 N051 0 BC847B
Q46 N050 N050 COM 0 BC857B
Q47 N053 N050 COM 0 BC857B
Q48 N056 N045 N050 0 BC857B
Q49 N045 N045 N053 0 BC857B
Q50 N058 N058 0 0 BC847B
Q51 N059 N058 0 0 BC847B
Q52 N047 N056 N058 0 BC847B
Q53 N056 N056 N059 0 BC847B
Q56 N040 N040 COM 0 BC857B
Q57 N042 N040 COM 0 BC857B
Q58 N047 N043 N040 0 BC857B
Q59 N043 N043 N042 0 BC857B
R21 N049 VREF 200
R25 N048 DRIVE 10k
R32 N048 VREF 200
R44 CV BSENSE2 4.7k
R53 VREF BSENSE2 3k
XU3 N047 N046 COM 0 CV MCP6021  ; pins In+ In- V+ V- OUT
R59 CV N046 2.2k
R60 N046 0 10k
C5 N047 0 20n
.model NPN NPN
.model PNP PNP
.lib standard.bjt
.tran 0 30m 10u 10n
* Current Sensing Theremin Oscillator with Sine Drive and Analog PLL
K1 L2 L3 1
* Sensing transformer
* Drive Amplifier
* VCO SVF Differential Integrator 1
* VCO SVF Differential Integrator 2
* VCO SVF Filter Input
* Phase Shift Integrator (Analog Multiplier)
* CV to Current
* Converter
* CV Current Sensing
* (*) Amp vs Freq
* Flatness Adjustment
.lib LMH6642.MOD
.lib MCP6021.cir
.backanno
.end